# Altium schematic sheet cons_motor.SchDoc
size A4
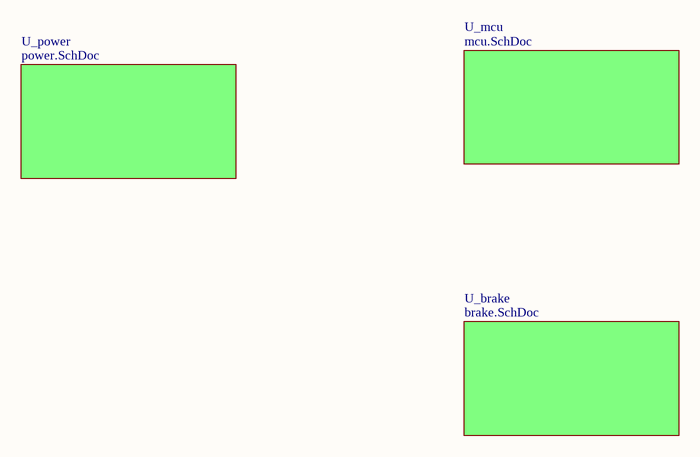
[diagram p0: cons_motor.SchDoc]

## Sub-sheets
U_brake = brake.SchDoc: no entries
U_mcu = mcu.SchDoc: no entries
U_power = power.SchDoc: no entries